# EAGLE design TinyDrop20_V1_1 (EAGLE 9.6.2)

## Sheet 1 of 2
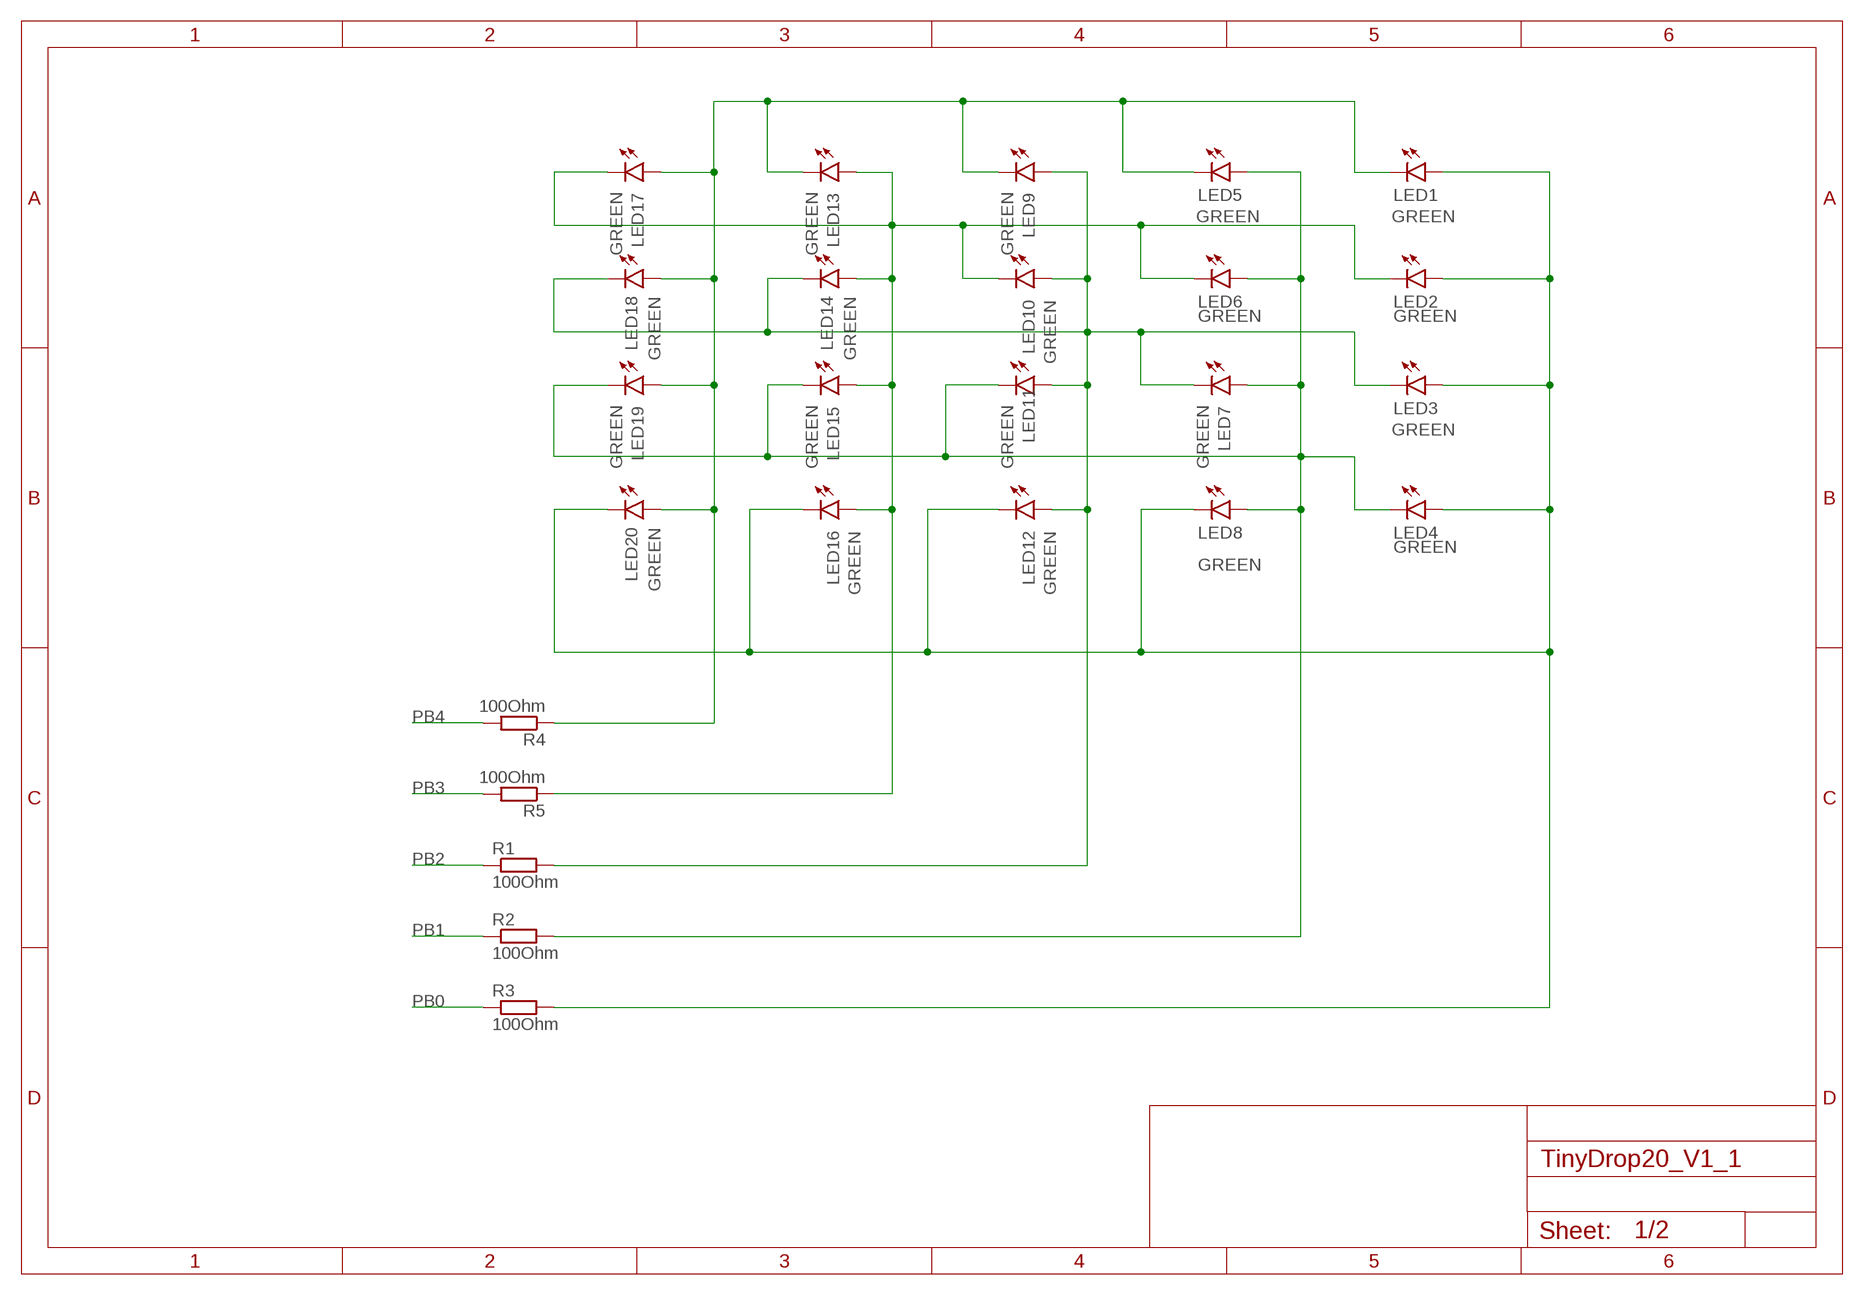
[diagram p0: schematic, sheet 1]

### Parts
LED1  GREEN  LED_0603_GREEN  [CHIPLED_0603]
LED2  GREEN  LED_0603_GREEN  [CHIPLED_0603]
LED3  GREEN  LED_0603_GREEN  [CHIPLED_0603]
LED4  GREEN  LED_0603_GREEN  [CHIPLED_0603]
LED5  GREEN  LED_0603_GREEN  [CHIPLED_0603]
LED6  GREEN  LED_0603_GREEN  [CHIPLED_0603]
LED7  GREEN  LED_0603_GREEN  [CHIPLED_0603]
LED8  GREEN  LED_0603_GREEN  [CHIPLED_0603]
LED9  GREEN  LED_0603_GREEN  [CHIPLED_0603]
LED10  GREEN  LED_0603_GREEN  [CHIPLED_0603]
LED11  GREEN  LED_0603_GREEN  [CHIPLED_0603]
LED12  GREEN  LED_0603_GREEN  [CHIPLED_0603]
LED13  GREEN  LED_0603_GREEN  [CHIPLED_0603]
LED14  GREEN  LED_0603_GREEN  [CHIPLED_0603]
LED15  GREEN  LED_0603_GREEN  [CHIPLED_0603]
LED16  GREEN  LED_0603_GREEN  [CHIPLED_0603]
LED17  GREEN  LED_0603_GREEN  [CHIPLED_0603]
LED18  GREEN  LED_0603_GREEN  [CHIPLED_0603]
LED19  GREEN  LED_0603_GREEN  [CHIPLED_0603]
LED20  GREEN  LED_0603_GREEN  [CHIPLED_0603]
R1  100Ohm  100R_RESISTOR-R0603  [R0603]
R2  100Ohm  100R_RESISTOR-R0603  [R0603]
R3  100Ohm  100R_RESISTOR-R0603  [R0603]
R4  100Ohm  100R_RESISTOR-R0603  [R0603]
R5  100Ohm  100R_RESISTOR-R0603  [R0603]

### Nets
N$5: LED1.A LED2.A LED3.A LED4.A LED8.C LED12.C LED16.C LED20.C R3.2
N$6: LED4.C LED5.A LED6.A LED7.A LED8.A LED11.C LED15.C LED19.C R2.2
N$7: LED3.C LED7.C LED9.A LED10.A LED11.A LED12.A LED14.C LED18.C R1.2
N$8: LED2.C LED6.C LED10.C LED13.A LED14.A LED15.A LED16.A LED17.C R5.1
N$9: LED1.C LED5.C LED9.C LED13.C LED17.A LED18.A LED19.A LED20.A R4.1
PB0: R3.1 ; also sheet 2
PB1: R2.1 ; also sheet 2
PB2: R1.1 ; also sheet 2
PB3: R5.2 ; also sheet 2
PB4: R4.2 ; also sheet 2

## Sheet 2 of 2
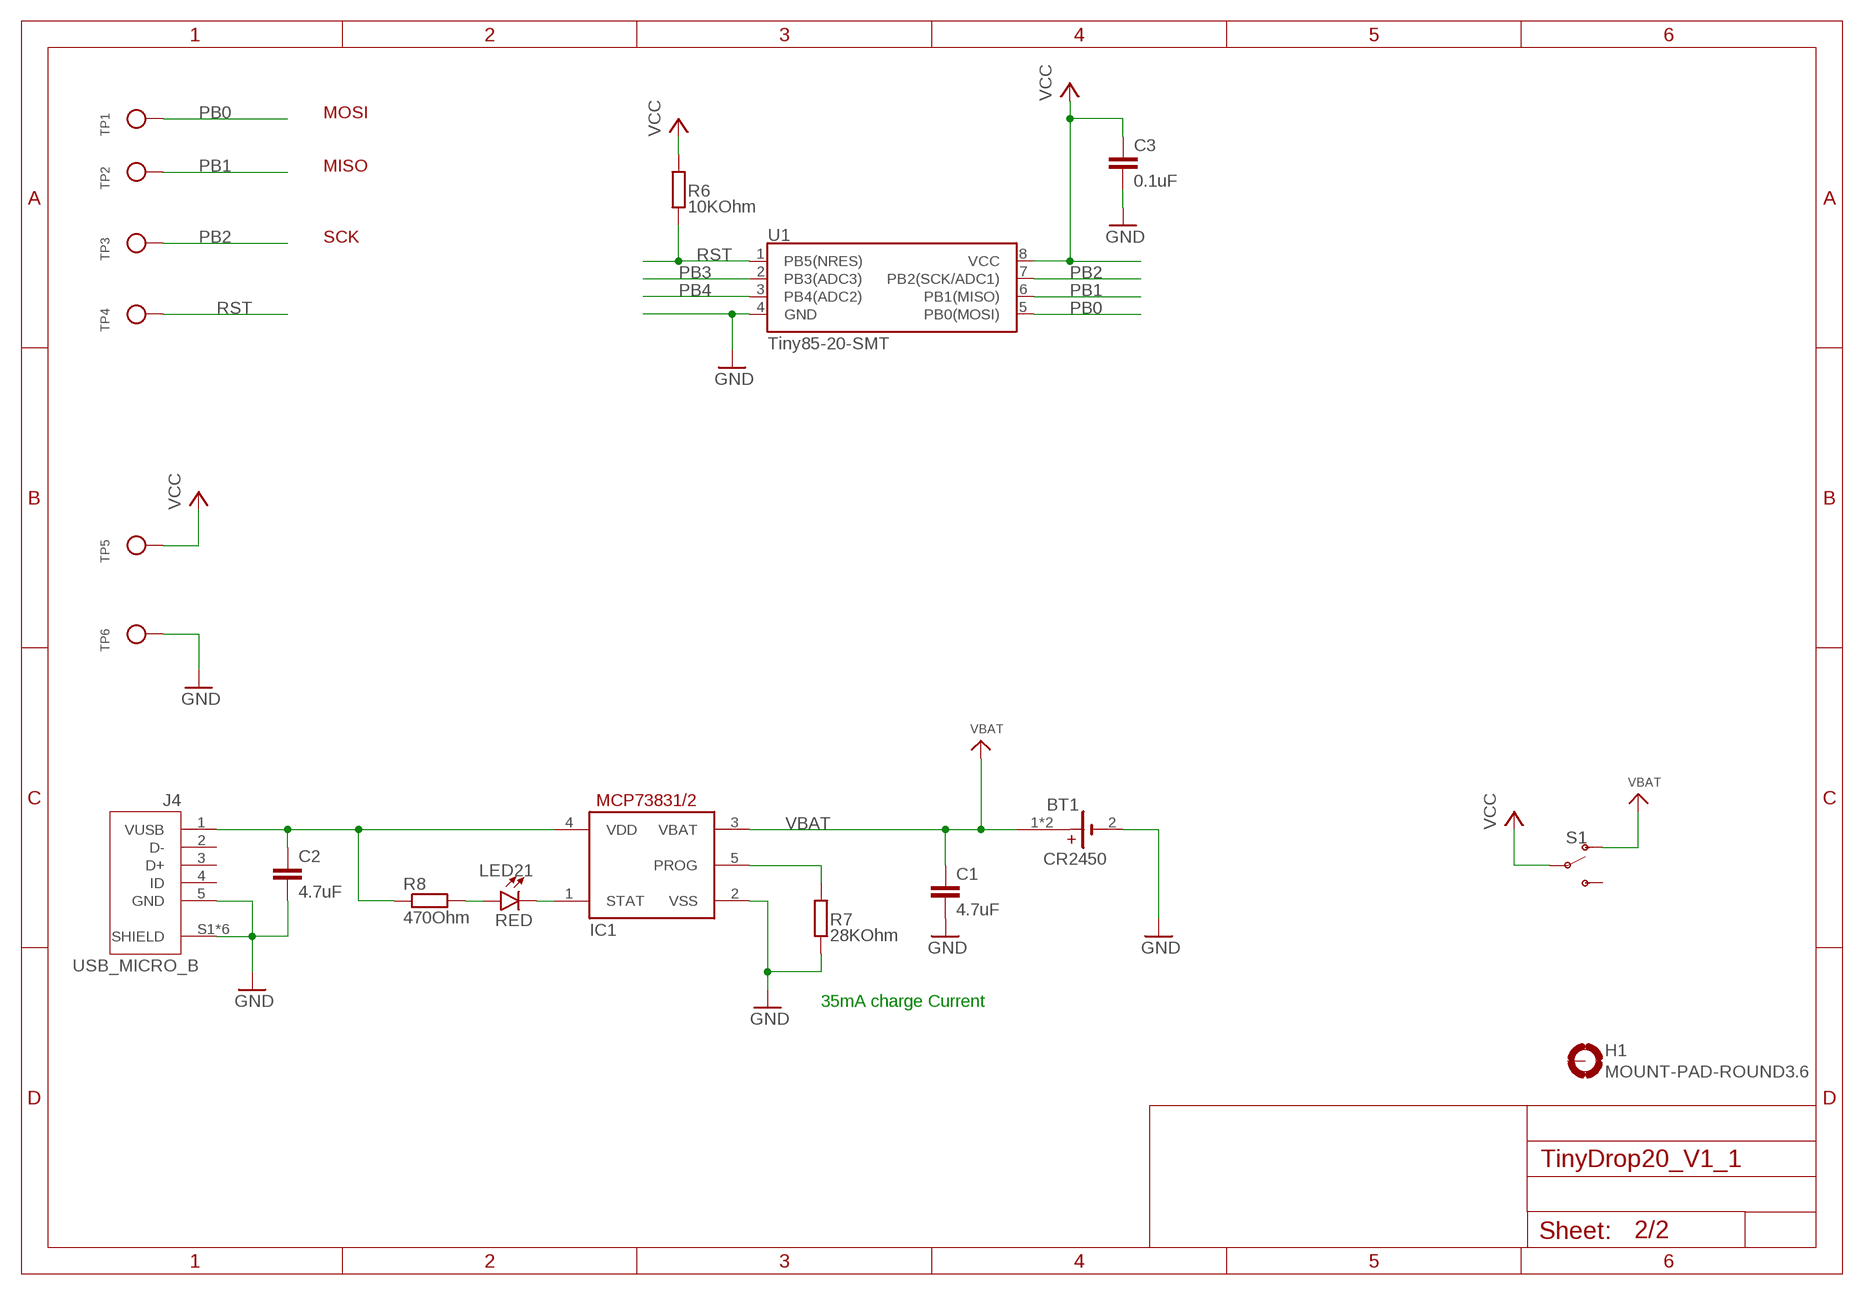
[diagram p1: schematic, sheet 2]

### Parts
BT1  CR2450  BAT_HOLDER_CR2450  [BATTCON_24.5X5MM_SMD]
C1  4.7uF  4.7UF_CERAMIC_CAPCITUOR-0805  [C0805]
C2  4.7uF  4.7UF_CERAMIC_CAPCITUOR-0805  [C0805]
C3  0.1uF  0.1UF_CERAMIC_CAPCITUOR-0805  [C0805]
H1  MOUNT-PAD-ROUND3.6  [3,6-PAD]
IC1  MCP73831/OT  [SOT23-5L]
J4  USB_MICRO_B  [FCI_10118193-0001LF]
LED21  RED  LED_0603_RED  [CHIPLED_0603]
R6  10KOhm  10K_RESISTOR-R0603  [R0603]
R7  28KOhm  28K_RESISTOR-R0603  [R0603]
R8  470Ohm  470R_RESISTOR-R0603  [R0603]
S1  SWITCH-SPDT-SMD-RIGHT-ANGLE  [SWITCH_SPST_SMD_A]
TP1  TESTPOINTROUND2MM  [TESTPOINT_ROUND_2MM]
TP2  TESTPOINTROUND2MM  [TESTPOINT_ROUND_2MM]
TP3  TESTPOINTROUND2MM  [TESTPOINT_ROUND_2MM]
TP4  TESTPOINTROUND2MM  [TESTPOINT_ROUND_2MM]
TP5  TESTPOINTROUND2MM  [TESTPOINT_ROUND_2MM]
TP6  TESTPOINTROUND2MM  [TESTPOINT_ROUND_2MM]
U1  Tiny85-20-SMT  ATTINY45-TINY85-20-SMT  [SO08-EIAJ_MCU]

### Nets
GND: BT1.2(-) C1.2 C2.2 C3.2 IC1.2(VSS) J4.5(GND) J4.S1(SHIELD) J4.S2(SHIELD) J4.S3(SHIELD) J4.S4(SHIELD) J4.S5(SHIELD) J4.S6(SHIELD) R7.1 TP6.P$1 U1.4(GND)
N$1: IC1.5(PROG) R7.2
N$2: C2.1 IC1.4(VDD) J4.1(VUSB) R8.1
N$3: IC1.1(STAT) LED21.C
N$4: LED21.A R8.2
PB0: TP1.P$1 U1.5(PB0(MOSI)) ; also sheet 1
PB1: TP2.P$1 U1.6(PB1(MISO)) ; also sheet 1
PB2: TP3.P$1 U1.7(PB2(SCK/ADC1)) ; also sheet 1
PB3: U1.2(PB3(ADC3)) ; also sheet 1
PB4: U1.3(PB4(ADC2)) ; also sheet 1
RST: R6.1 TP4.P$1 U1.1(PB5(NRES))
VBAT: BT1.1(+) BT1.3(+) C1.1 IC1.3(VBAT) S1.1(O)
VCC: C3.1 R6.2 S1.2(P) TP5.P$1 U1.8(VCC)
Unconnected: H1.B3,6(MOUNT) J4.2(D-) J4.3(D+) J4.4(ID) S1.3(S)

### Notes on the sheet
- MOSI
- MISO
- SCK
- 35mA charge Current

## Library data of the parts
BT1 = OF-Battery:BAT_HOLDER
C1 C2 = OF-Capacitor :4.7UF_CERAMIC_CAPCITUOR; DESCRIPTION: CAP CER 4.7UF 10V X7R 0805; FOOTPRINT: C0805; MF: TDK Corporation; MPN: C2012X7R1A475M125AC
C3 = OF-Capacitor :0.1UF_CERAMIC_CAPCITUOR; FOOTPRINT: C0805; MF: Yageo
H1 = holes:MOUNT-PAD-ROUND: MOUNTING PAD, round
IC1 = OF-Powe-IC:MCP73831: MCP73831/2 Miniature Single-Cell, Fully Integrated Li-Ion, Li-Polymer Charge Management Controllers. Nice and small simple lipoly charge controller, with adjustable current and status output (LED) http://www.ladyada.net/library/pcb/eaglelibrary.html; DESCRIPTION: IC CONTROLLR LI-ION 4.2V SOT23-5; FOOTPRINT: SOT-23-5; MF: Microchip Technology; MPN: MCP73831T-2ACI/OT
J4 = OF-Connectors:USB_MICRO_B: Micro USB B Type Receptacle; DESCRIPTION: Single Port 5 Contact Shielded SMT MICRO USB B-Type Receptacle; FOOTPRINT: None; MF: Amphenol ICC; MPN: 10118193-0001LF
LED1-LED20 = OF-LED:LED_0603; DESCRIPTION: Green 571nm LED Indication - Discrete 2V 0603; FOOTPRINT: 0603; MF: Lite-On Inc.; MPN: LTST-C190KGKT
LED21 = OF-LED:LED_0603; DESCRIPTION: Red 631nm LED Indication - Discrete 2V 0603; FOOTPRINT: 0603; MF: Lite-On Inc.; MPN: LTST-C191KRKT
R1-R5 = OF-Resistors:100R_RESISTOR; FOOTPRINT: R0603; MF: Yageo
R6 = OF-Resistors:10K_RESISTOR; DESCRIPTION: RES SMD 10K OHM 1% 1/10W 0603; FOOTPRINT: R0603; MF: Yageo; MPN: RC0603FR-0710KL
R7 = OF-Resistors:28K_RESISTOR; DESCRIPTION: RES SMD 28K OHM 1% 1/10W 0603; FOOTPRINT: R0603; MF: Yageo; MPN: RC0603FR-0728KL
R8 = OF-Resistors:470R_RESISTOR; DESCRIPTION: RES SMD 470 OHM 1% 1/10W 0603; FOOTPRINT: R0603; MF: Bourns Inc; MPN: CR0603-FX-4700ELF
S1 = SparkFun-Switches:SWITCH-SPDT: Single Pole, Double Throw (SPDT) Switch Single-pole, double-throw (SPDT) switch. Variant Overview SMD-AYZ0202 Surface Mount DPDT Switch <https://www.sparkfun.com/products/597> (COM-00597) Used on e.g. LilyPad Arduino USB - ATmega32U4 Board <https://www.sparkfun.com/products/12049> PTH-11.6X4.0MM SPDT Mini Power Switch <https://www.sparkfun.com/products/102> (COM-00102) Used on e.g. SparkFun Simon Says - Through-Hole Soldering Kit <https://www.sparkfun.com/products/10547> (KIT-10547) PTH-11.6X4.0MM-KIT KIT version of SPDT Mini Power Switch - Simplifies soldering by removing tStop of switch pins - only one side can be soldered. PTH-11.6X4.0MM-LOCK LOCK version of SPDT Mini Power Switch - Offset pins hold switch in place for easier soldering. SMD-RIGHT-ANGLE Surface Mount Right Angle Switch <https://www.sparkfun.com/products/10860> (COM-10860) Used on e.g. SparkFun ESP8266 Thing <https://www.sparkfun.com/products/13231>; PROD_ID: SWCH-10651; SF_SKU: COM-10860
TP1-TP6 = mainBoard3D:TESTPOINT: Test Point Various test points for characterisation and PCB testing TESTPOINT_SMT - Compact Surface Mount Test Point [Digikey: 5016KTR-ND]
U1 = OF-IC-MCU:ATTINY45: Atmel 8-pin 2/4/8kB flash uC Retired; DESCRIPTION: IC MCU 8BIT 8KB FLASH 8SOIC; FOOTPRINT: 8-SOIC; MF: Microchip Technology; MPN: ATTINY85-20SU

## Board
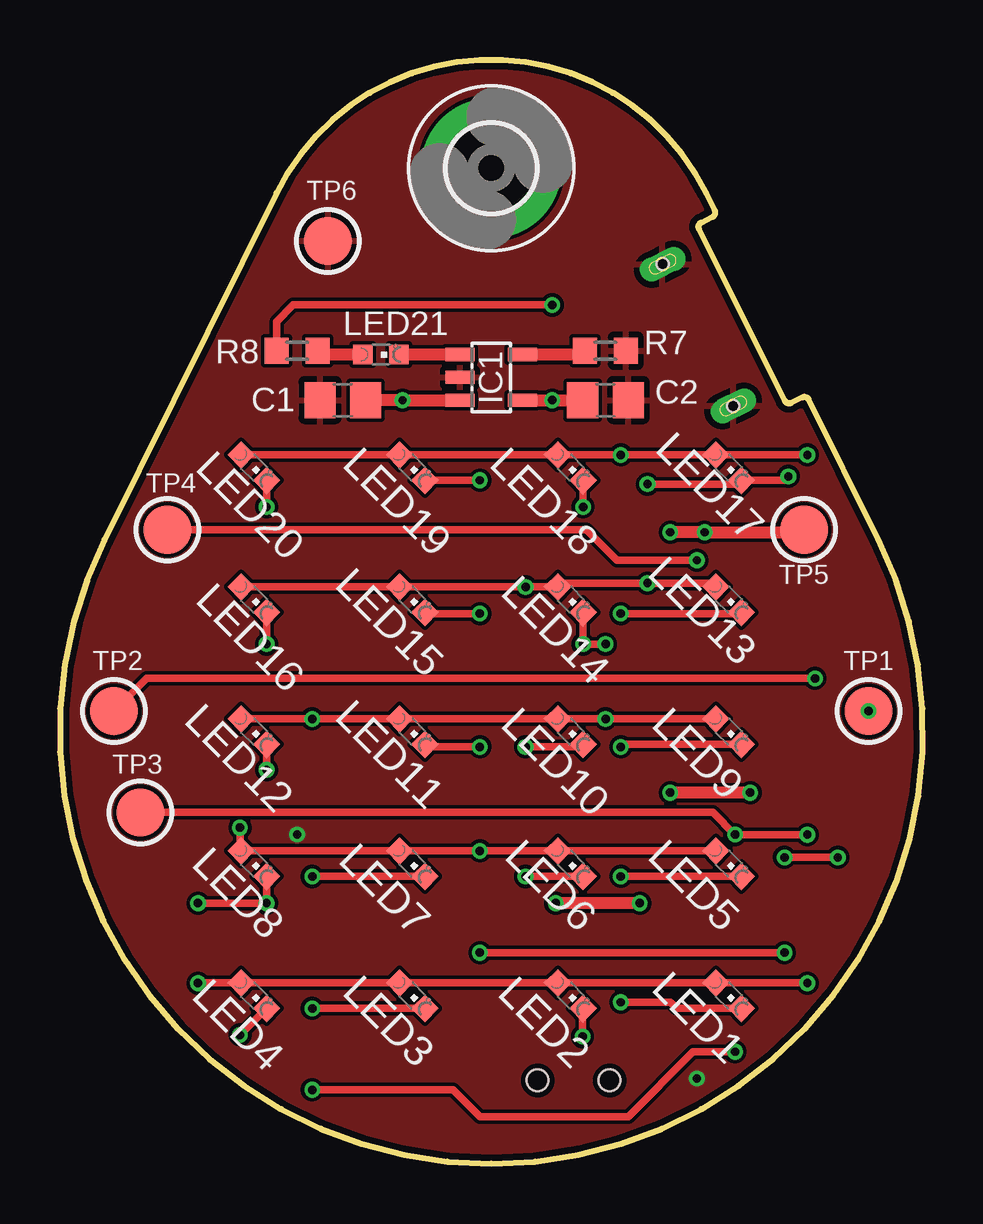
[diagram p2: board, top side]
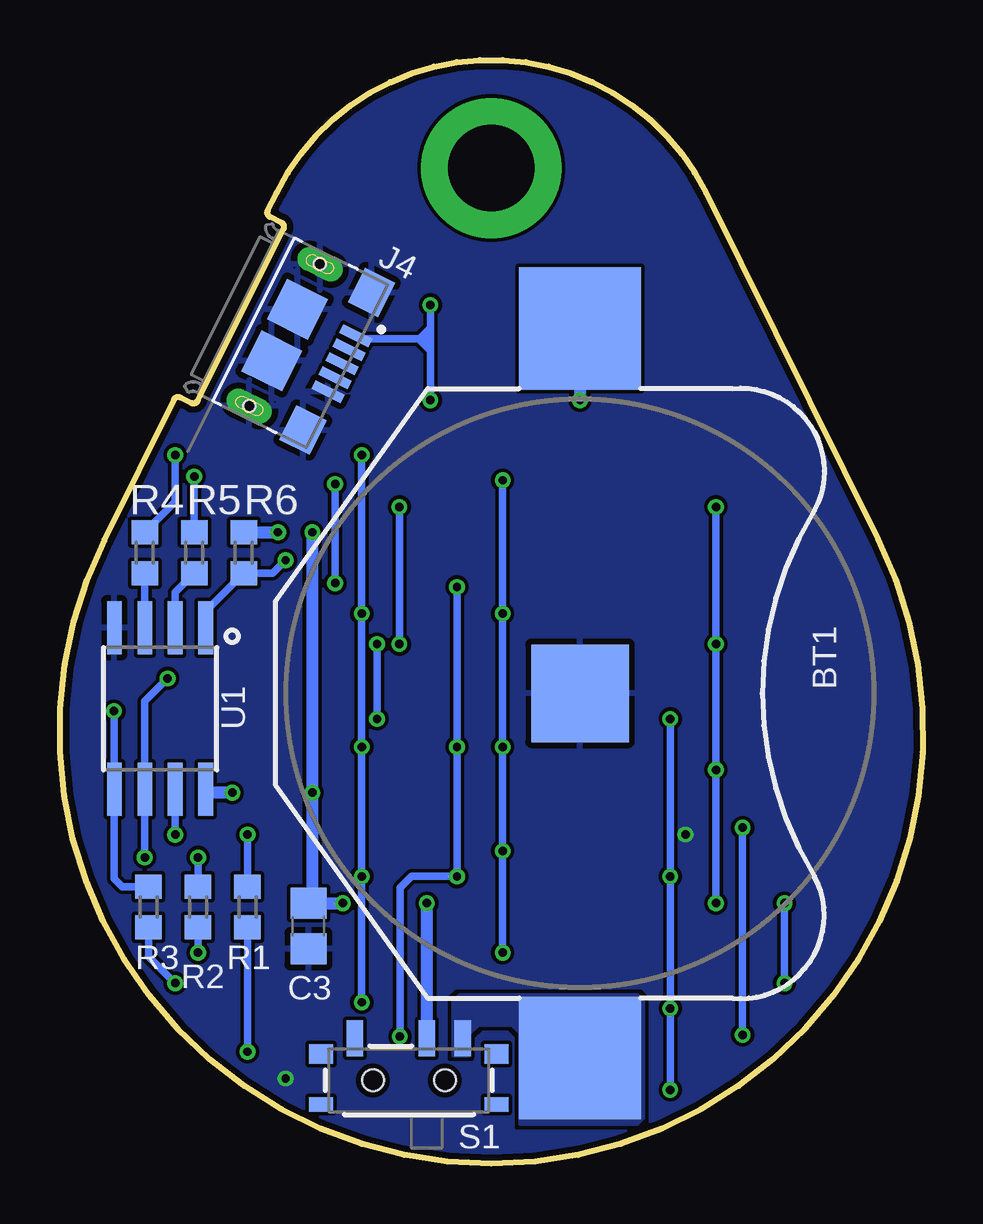
[diagram p3: board, bottom side, seen from below]

Size 35.96 x 45.99 mm. Coordinates in mm from the lower left corner, seen from the top.
Outline: 30.22,31.79 26.64,38.95 arc-90 26.73,39.22 27.21,39.45 arc90 27.3,39.72 26.94,40.44 arc127 9.02,40.44 1.86,26 arc233 34.11,26 31.21,31.84 arc90 30.94,31.93 30.49,31.7 arc-90 30.22,31.79
Copper layers (1*16): Top 0.035mm / dielectric 1.5mm / Bottom 0.035mm
Design rules "SeeedStudio_2layer_DRU_no_angle_20140221": minimum track width 6mil, minimum drill 12mil, track to track 6mil, track to pad 6mil, pad to pad 6mil, via to via 6mil, smd to smd 0mil, copper to edge 10mil, drill to drill 10mil, minimum pad ring 10mil, minimum via ring 6mil, stop-mask expansion 2mil, vias tented up to drill 100mil, thermal gap 10mil

### Footprints (pad centres in the part's own frame; a part is rotated, then mirrored left to right if it is on the bottom)
BATTCON_24.5X5MM_SMD = smd 5.1 x 5.1: 1 -15.2,0; 3 15.2,0 | smd 4.064 x 4.064: 2 0,0
C0805 = smd 1.3 x 1.5: 1 -0.95,0; 2 0.95,0
3,6-PAD = drill 3.6 pad 5.842: B3,6 0,0
SOT23-5L = smd 0.55 x 1.2: 1 -0.95,-1.3; 2 0,-1.3; 3 0.95,-1.3; 4 0.95,1.3; 5 -0.95,1.3
FCI_10118193-0001LF = smd 0.4 x 1.35: 1 -1.3,2.675; 2 -0.65,2.675; 3 0,2.675; 4 0.65,2.675; 5 1.3,2.675 | smd 1.6 x 1.4: S1 -3.2,2.45; S2 3.2,2.45 | smd 1.9 x 1.9: S3 1.2,0; S4 -1.2,0 | drill 0.5 pad 0.9 long: S5 -3.3,0; S6 3.3,0 | hole 0.5: -3.3,0; 3.3,0
CHIPLED_0603 = smd 0.8 x 0.8: A 0,-0.75; C 0,0.75
R0603 = smd 1 x 1.1: 1 -0.85,0; 2 0.85,0
SWITCH_SPST_SMD_A = smd 0.7 x 1.5: 1 -2.25,-1.75; 2 -0.75,-1.75; 3 2.25,-1.75 | smd 1 x 0.6: GND1 -3.65,1; GND3 3.65,1 | smd 1 x 0.8: GND2 -3.65,-1.1; GND4 3.65,-1.1 | hole 0.9: -1.5,0; 1.5,0
TESTPOINT_ROUND_2MM = smd 2 x 2: P$1 0,0
SO08-EIAJ_MCU = smd 0.61 x 2.21: 1 -1.905,-3.378; 2 -0.635,-3.378; 3 0.635,-3.378; 4 1.905,-3.378; 5 1.905,3.353; 6 0.635,3.353; 7 -0.635,3.353; 8 -1.905,3.353

### Placement (x,y rotation side)
BT1  14.28,19.6 270 bottom
C1  11.79,31.81 180 top
C2  22.74,31.81 0 top
C3  25.6,9.9 270 bottom
H1  17.98,41.48 0 top
IC1  17.98,32.76 270 top
J4  26.6,34.53 243.5 bottom
LED1  27.88,7 225 top
LED2  21.28,7 225 top
LED3  14.68,7 225 top
LED4  8.08,7 225 top
LED5  27.88,12.5 225 top
LED6  21.28,12.5 225 top
LED7  14.68,12.5 225 top
LED8  8.08,12.5 225 top
LED9  27.88,18 225 top
LED10  21.28,18 225 top
LED11  14.68,18 225 top
LED12  8.08,18 225 top
LED13  27.88,23.5 225 top
LED14  21.28,23.5 225 top
LED15  14.68,23.5 225 top
LED16  8.08,23.5 225 top
LED17  27.88,29 225 top
LED18  21.28,29 225 top
LED19  14.68,29 225 top
LED20  8.08,29 225 top
LED21  13.38,33.72 270 top
R1  28.14,10.7 270 bottom
R2  30.2,10.7 270 bottom
R3  32.27,10.7 270 bottom
R4  32.43,25.46 270 bottom
R5  30.36,25.46 270 bottom
R6  28.3,25.46 90 bottom
R7  22.74,33.88 180 top
R8  9.88,33.88 0 top
S1  21.42,3.47 180 bottom
TP1  33.71,18.86 0 top
TP2  2.25,18.86 0 top
TP3  3.36,14.63 180 top
TP4  4.47,26.41 0 top
TP5  31.01,26.41 0 top
TP6  11.17,38.45 0 top
U1  31.79,18.95 180 bottom

### Tracks (layer width: path | path; a pad name or v marks a point on that pad's centre or on a via)
GND  (via drill 0.35)
  other vias: 9.88,13.71 26.55,3.55
  pour Bottom (rank 2): 34.11,26 arc-233 1.86,26 9.02,40.44 arc-127 26.94,40.44
  pour Top: 9.02,40.44 1.86,26 arc233 34.11,26 26.94,40.44 arc127
N$1
  Top 0.508: R7.2 21.73,33.71 IC1.5
N$2  (via drill 0.35)
  Top 0.305: v20.52,35.78 9.73,35.78 9.03,35.09 R8.1
  Top 0.508: IC1.4 v20.52,31.81 C2.1
  Bottom 0.305: v20.52,31.81 20.52,33.88 | 20.52,33.88 20.52,34.37 | J4.1 23.5,34.37 21.02,34.37 | 21.02,34.37 20.98,34.37 | 20.98,34.37 20.52,34.37 | 20.52,34.37 20.52,34.83 | 20.52,34.83 v20.52,35.78 | 20.52,34.83 20.98,34.37 | 21.02,34.37 20.52,33.88
N$3
  Top 0.508: IC1.1 LED21.C
N$4
  Top 0.508: LED21.A 10.89,33.72 R8.2
N$5  (via drill 0.35)
  Top 0.305: v31.16,7.52 31.15,7.53 LED1.A LED2.A LED3.A LED4.A v5.76,7.53 v5.76,7.52 | LED20.C v8.61,27.37 | v8.61,21.65 v8.61,21.66 LED16.C | v8.61,16.41 v8.61,16.42 LED12.C | LED8.C v8.61,10.86 v5.76,10.86
  Bottom 0.305: R3.2 32.27,8.63 v31.16,7.52 | v8.61,27.37 v8.61,21.65 v8.61,16.41 v8.61,10.86 | v5.76,10.86 v5.76,7.52
N$6  (via drill 0.35)
  Top 0.305: LED5.A LED6.A v17.5,13.03 LED7.A LED8.A 7.5,13.08 v7.5,14 | v30.2,8.79 v17.5,8.79 | LED19.C v17.5,28.47 v17.5,28.48 | v17.5,22.92 15.26,22.92 LED15.C | v17.5,17.37 15.32,17.37 LED11.C | v7.5,5.36 LED4.C
  Bottom 0.305: R2.2 | R2.2 v30.2,8.79 | v17.5,8.79 v17.5,13.03 v17.5,17.37 v17.5,22.92 v17.5,28.48 | v7.5,14 v7.5,5.36
N$7  (via drill 0.35)
  Top 0.305: LED12.A v10.52,18.53 LED11.A LED10.A v22.74,18.53 LED9.A | LED18.C v21.81,27.37 | LED14.C v21.81,21.65 v22.74,21.65 | LED3.C v10.52,6.47 | LED7.C v10.52,11.97 | v10.52,3.08 16.39,3.08 17.5,1.97 23.7,1.97 26.39,4.67 v28.14,4.67
  Bottom 0.305: v21.81,27.37 v21.81,21.65 | v22.74,21.65 v22.74,18.53 | R1.2 v28.14,4.67 | v28.14,4.67 | v10.52,18.53 v10.52,11.97 v10.52,6.47 v10.52,3.08
N$8  (via drill 0.35)
  Top 0.305: LED16.A LED15.A v19.41,24.03 LED14.A 20.91,24.19 v24.49,24.19 27.19,24.19 LED13.A | v30.36,28.64 30.2,28.47 LED17.C 28.26,28.32 v24.49,28.32 | v21.79,5.3 21.79,6.45 LED2.C | v19.41,11.97 LED6.C | LED10.C 21.71,17.37 v19.41,17.37
  Bottom 0.305: R5.1 v30.36,28.64 | v30.36,28.64 | v24.49,28.32 v24.49,24.19 | v19.41,24.03 v19.41,17.37 v19.41,11.97 21.31,11.97 21.79,11.49 v21.79,5.3
N$9  (via drill 0.35)
  Top 0.305: LED20.A LED19.A LED18.A v23.38,29.53 LED17.A v31.16,29.53 | LED13.C 28.36,22.92 v23.38,22.92 | v23.38,17.37 23.48,17.47 LED9.C | LED5.C v23.38,11.97 | v23.38,6.73 25.44,6.73 25.7,6.47 LED1.C
  Bottom 0.305: v31.16,29.53 31.16,27.58 R4.1 | v23.38,29.53 v23.38,22.92 v23.38,17.37 v23.38,11.97 v23.38,6.73
PB0  (via drill 0.35)
  Bottom 0.305: R3.1 33.37,11.55 33.7,11.87 U1.5 33.7,18.84 TP1.P$1
  other vias: 33.71,18.86
PB1  (via drill 0.35)
  Top 0.305: v32.43,12.76 v30.2,12.76 | TP2.P$1 3.62,20.22 v31.47,20.22
  Bottom 0.305: v32.43,12.76 U1.6 32.43,19.27 v31.47,20.22 | v32.43,12.76 | v30.2,12.76 R2.1 | R2.1
PB2  (via drill 0.35)
  Top 0.305: v31.16,13.71 v28.14,13.71 27.22,14.63 TP3.P$1
  Bottom 0.305: U1.7 | U1.7 v31.16,13.71 | v28.14,13.71 R1.1
PB3
  Bottom 0.305: U1.2 31.16,23.82 R5.2
PB4
  Bottom 0.305: U1.3 R4.2
RST  (via drill 0.35)
  Top 0.305: v26.55,25.14 23.22,25.14 21.95,26.41 TP4.P$1
  Bottom 0.305: U1.1 29.89,23.02 R6.1 27.09,24.61 v26.55,25.14
VBAT  (via drill 0.35)
  Top 0.508: IC1.3 v14.28,31.81 C1.1
  Bottom 0.508: BT1.1 v14.28,31.81
  pour Bottom (no thermals): 16.77,5.43 16.77,1.65 11.88,1.65 11.63,1.9 11.63,6.79 11.88,7.05 19.31,7.05 19.57,6.79 19.57,4.51 18.93,4.51 18.93,5.36 18.52,5.78 17.12,5.78
VCC  (via drill 0.35)
  Top 0.508: v24.17,10.86 v20.67,10.86 | v28.78,15.46 v25.44,15.46 | v25.44,26.31 v26.87,26.31 30.91,26.31 TP5.P$1
  Bottom 0.508: S1.2 v20.67,10.86 | v24.17,10.86 v24.17,10.85 C3.1 25.44,11.01 v25.44,15.46 | v25.44,15.46 | v28.78,15.46 29.75,15.46 U1.8 | R6.2 v26.87,26.31 | v25.44,26.31 v25.44,15.46